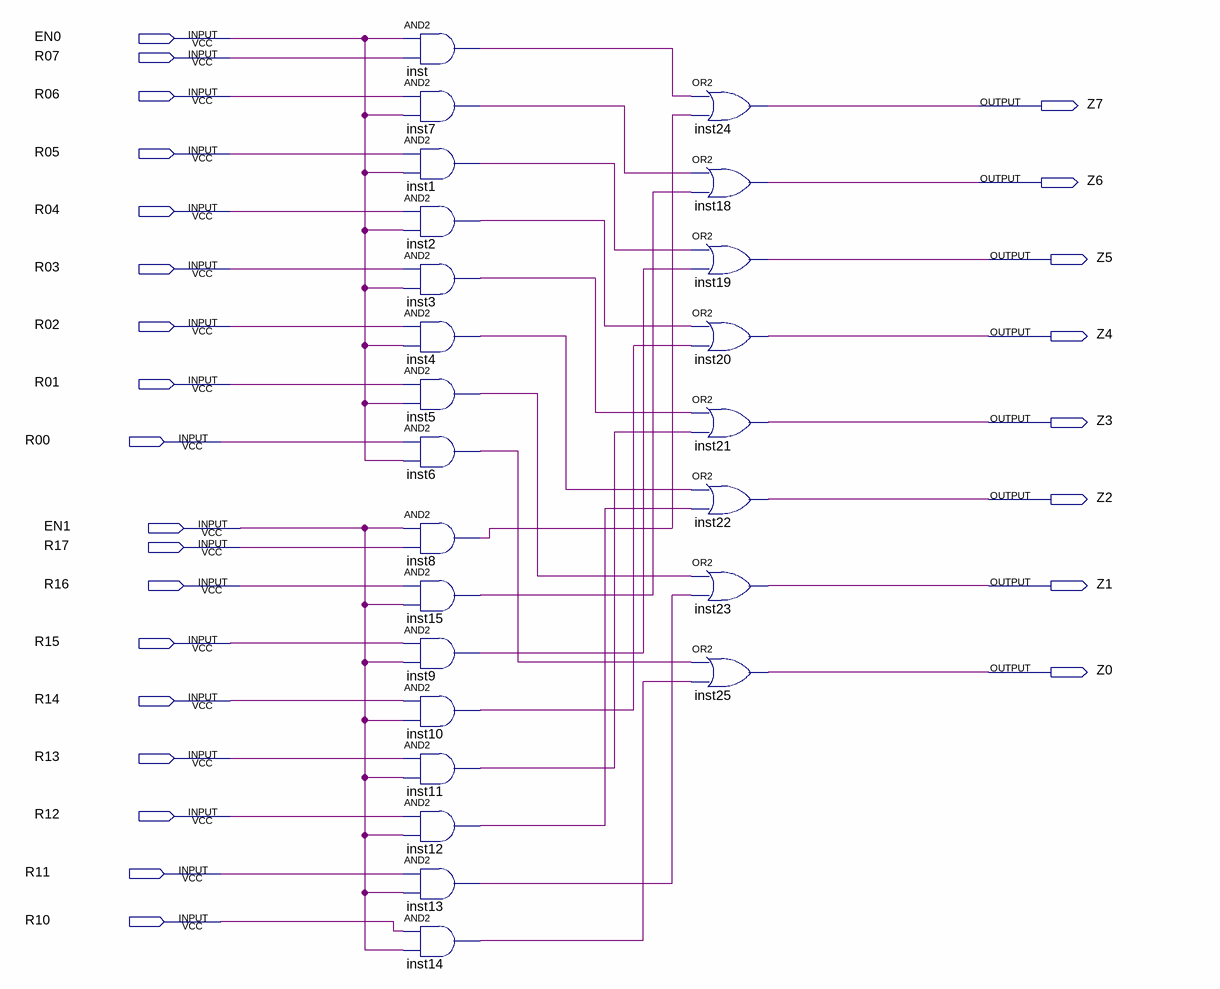
[diagram p0: schematic sheet]
// Quartus schematic selector.bdf as structural Verilog: 24 symbols, 26 pins
module selector (
  input  EN0,
  input  R07,
  input  R06,
  input  R05,
  input  R04,
  input  R03,
  input  R02,
  input  R01,
  input  R00,
  input  EN1,
  input  R17,
  input  R16,
  input  R15,
  input  R14,
  input  R13,
  input  R12,
  input  R11,
  input  R10,
  output Z7,
  output Z6,
  output Z5,
  output Z4,
  output Z3,
  output Z2,
  output Z1,
  output Z0
);

  wire inst1_out, inst2_out, inst3_out, inst4_out, inst5_out, inst6_out, inst7_out, inst8_out, inst9_out,
       inst10_out, inst11_out, inst12_out, inst13_out, inst14_out, inst15_out, inst_out;

  and inst (inst_out, EN0, R07);
  and inst7 (inst7_out, R06, EN0);
  and inst1 (inst1_out, R05, EN0);
  and inst2 (inst2_out, R04, EN0);
  and inst3 (inst3_out, R03, EN0);
  and inst4 (inst4_out, R02, EN0);
  and inst5 (inst5_out, R01, EN0);
  and inst6 (inst6_out, R00, EN0);
  and inst8 (inst8_out, EN1, R17);
  and inst15 (inst15_out, R16, EN1);
  and inst9 (inst9_out, R15, EN1);
  and inst10 (inst10_out, R14, EN1);
  and inst11 (inst11_out, R13, EN1);
  and inst12 (inst12_out, R12, EN1);
  and inst13 (inst13_out, R11, EN1);
  and inst14 (inst14_out, R10, EN1);
  or inst24 (Z7, inst_out, inst8_out);
  or inst18 (Z6, inst7_out, inst15_out);
  or inst19 (Z5, inst1_out, inst9_out);
  or inst20 (Z4, inst2_out, inst10_out);
  or inst21 (Z3, inst3_out, inst11_out);
  or inst22 (Z2, inst4_out, inst12_out);
  or inst23 (Z1, inst5_out, inst13_out);
  or inst25 (Z0, inst6_out, inst14_out);
endmodule
